# EAGLE design TDFN33-10 (EAGLE 7.3.0)
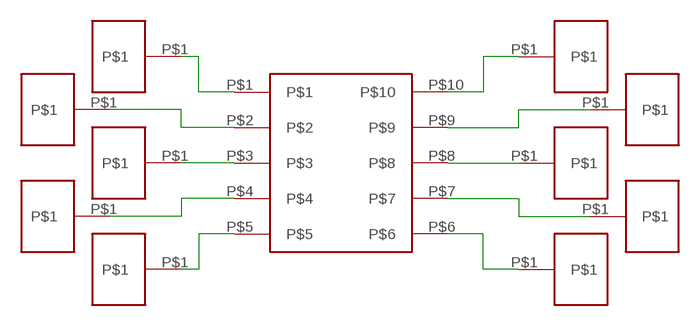
[diagram p0: schematic, sheet 1]

## Parts
U$1  TDFN33-10TDFN33-10  [TDFN33-10]
U$2  PAD50X100MIL  [100X50MIL_PAD]
U$3  PAD50X100MIL  [100X50MIL_PAD]
U$4  PAD50X100MIL  [100X50MIL_PAD]
U$5  PAD50X100MIL  [100X50MIL_PAD]
U$6  PAD50X100MIL  [100X50MIL_PAD]
U$7  PAD50X100MIL  [100X50MIL_PAD]
U$8  PAD50X100MIL  [100X50MIL_PAD]
U$9  PAD50X100MIL  [100X50MIL_PAD]
U$10  PAD50X100MIL  [100X50MIL_PAD]
U$11  PAD50X100MIL  [100X50MIL_PAD]

## Nets
N$1: U$1.P$3 U$2.P$1
N$2: U$1.P$2 U$3.P$1
N$3: U$1.P$4 U$4.P$1
N$4: U$1.P$5 U$6.P$1
N$5: U$1.P$1 U$5.P$1
N$6: U$1.P$8 U$7.P$1
N$7: U$1.P$9 U$8.P$1
N$8: U$1.P$7 U$9.P$1
N$9: U$1.P$10 U$10.P$1
N$10: U$1.P$6 U$11.P$1

## Library data of the parts
U$1 = generic_smd:TDFN33-10
U$2-U$11 = generic_smd:PAD

## Board
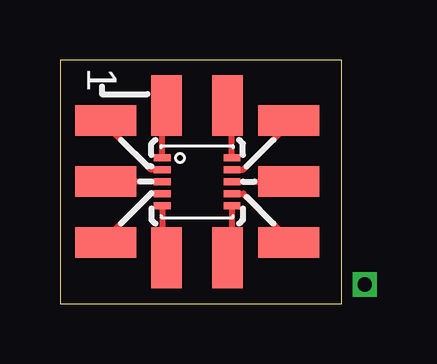
[diagram p1: board, top side]
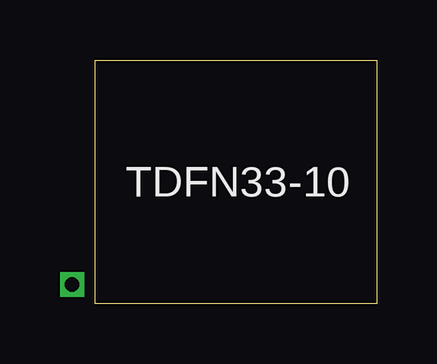
[diagram p2: board, bottom side, seen from below]

Size 11.73 x 10.15 mm. Coordinates in mm from the lower left corner, seen from the top.
Outline: 0,0 11.73,0 11.73,10.15 0,10.15 0,0
Copper layers (1*16): Top 0.035mm / dielectric 1.5mm / Bottom 0.035mm
Design rules "default": minimum track width 10mil, minimum drill 24mil, track to track 8mil, track to pad 8mil, pad to pad 8mil, via to via 8mil, smd to smd 8mil, copper to edge 40mil, drill to drill 8mil, minimum pad ring 10mil, minimum via ring 8mil, stop-mask expansion 4mil, vias tented up to drill 0mil, thermal gap 10mil

### Footprints (pad centres in the part's own frame; a part is rotated, then mirrored left to right if it is on the bottom)
TDFN33-10 = smd 0.7 x 0.3: P$1 -1.45,-1; P$2 -1.45,-0.5; P$3 -1.45,0; P$4 -1.45,0.5; P$5 -1.45,1; P$6 1.45,1; P$7 1.45,0.5; P$8 1.45,0; P$9 1.45,-0.5; P$10 1.45,-1
100X50MIL_PAD = smd 1.27 x 2.54: P$1 0,0

### Placement (x,y rotation side)
U$1  5.71,5.08 0 top
U$2  1.91,5.08 90 top
U$3  1.91,2.54 270 top
U$4  1.91,7.62 90 top
U$5  4.45,1.91 180 top
U$6  4.45,8.26 180 top
U$7  9.53,5.08 90 top
U$8  9.53,2.54 90 top
U$9  9.53,7.62 90 top
U$10  6.99,1.91 180 top
U$11  6.99,8.26 180 top

### Tracks (layer width: path | path; a pad name or v marks a point on that pad's centre or on a via)
N$1
  Top 0.254: U$1.P$3 U$2.P$1
N$2
  Top 0.254: U$1.P$2 3.79,4.58 2.22,3.02 2.22,2.86 U$3.P$1
N$3
  Top 0.254: U$1.P$4 3.79,5.58 2.22,7.14 2.22,7.3 U$4.P$1
N$4
  Top 0.254: U$1.P$5 4.26,8.07 U$6.P$1
N$5
  Top 0.254: U$1.P$1 4.26,2.08 U$5.P$1
N$6
  Top 0.254: U$1.P$8 U$7.P$1
N$7
  Top 0.254: U$1.P$9 7.64,4.58 9.21,3.02 9.21,2.86 U$8.P$1
N$8
  Top 0.254: U$1.P$7 7.64,5.58 9.21,7.14 9.21,7.3 U$9.P$1
N$9
  Top 0.254: U$1.P$10 7.17,2.08 U$10.P$1
N$10
  Top 0.254: U$1.P$6 7.17,8.07 U$11.P$1
N$11  (via drill 0.6)
  other vias: 12.7,0.79

### Text on the board
tPlace: 1
bPlace: TDFN33-10
Document: via required to force drill file generation